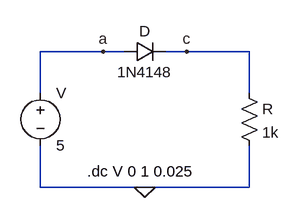
[diagram p0: schematic 1-iv.asc]
1-iv.asc, the LTspice schematic file:
Version 4.1
SHEET 1 880 680
WIRE 144 16 48 16
WIRE 176 16 144 16
WIRE 272 16 240 16
WIRE 368 16 272 16
WIRE 48 80 48 16
WIRE 368 80 368 16
WIRE 48 224 48 160
WIRE 208 224 48 224
WIRE 368 224 368 160
WIRE 368 224 208 224
FLAG 144 16 a
FLAG 272 16 c
FLAG 208 224 0
SYMBOL voltage 48 64 R0
SYMATTR InstName V
SYMATTR Value 5
SYMBOL res 352 64 R0
SYMATTR InstName R
SYMATTR Value 1k
SYMBOL diode 176 32 R270
WINDOW 0 32 32 VTop 2
WINDOW 3 0 32 VBottom 2
SYMATTR InstName D
SYMATTR Value 1N4148
TEXT 120 200 Left 2 !.dc V 0 1 0.025

The netlist it stands for:
* 1-iv.asc
V a 0 5
R c 0 1k
D a c 1N4148
.model D D
.lib standard.dio
.dc V 0 1 0.025
.backanno
.end